# EAGLE design VDC (EAGLE 6.0)
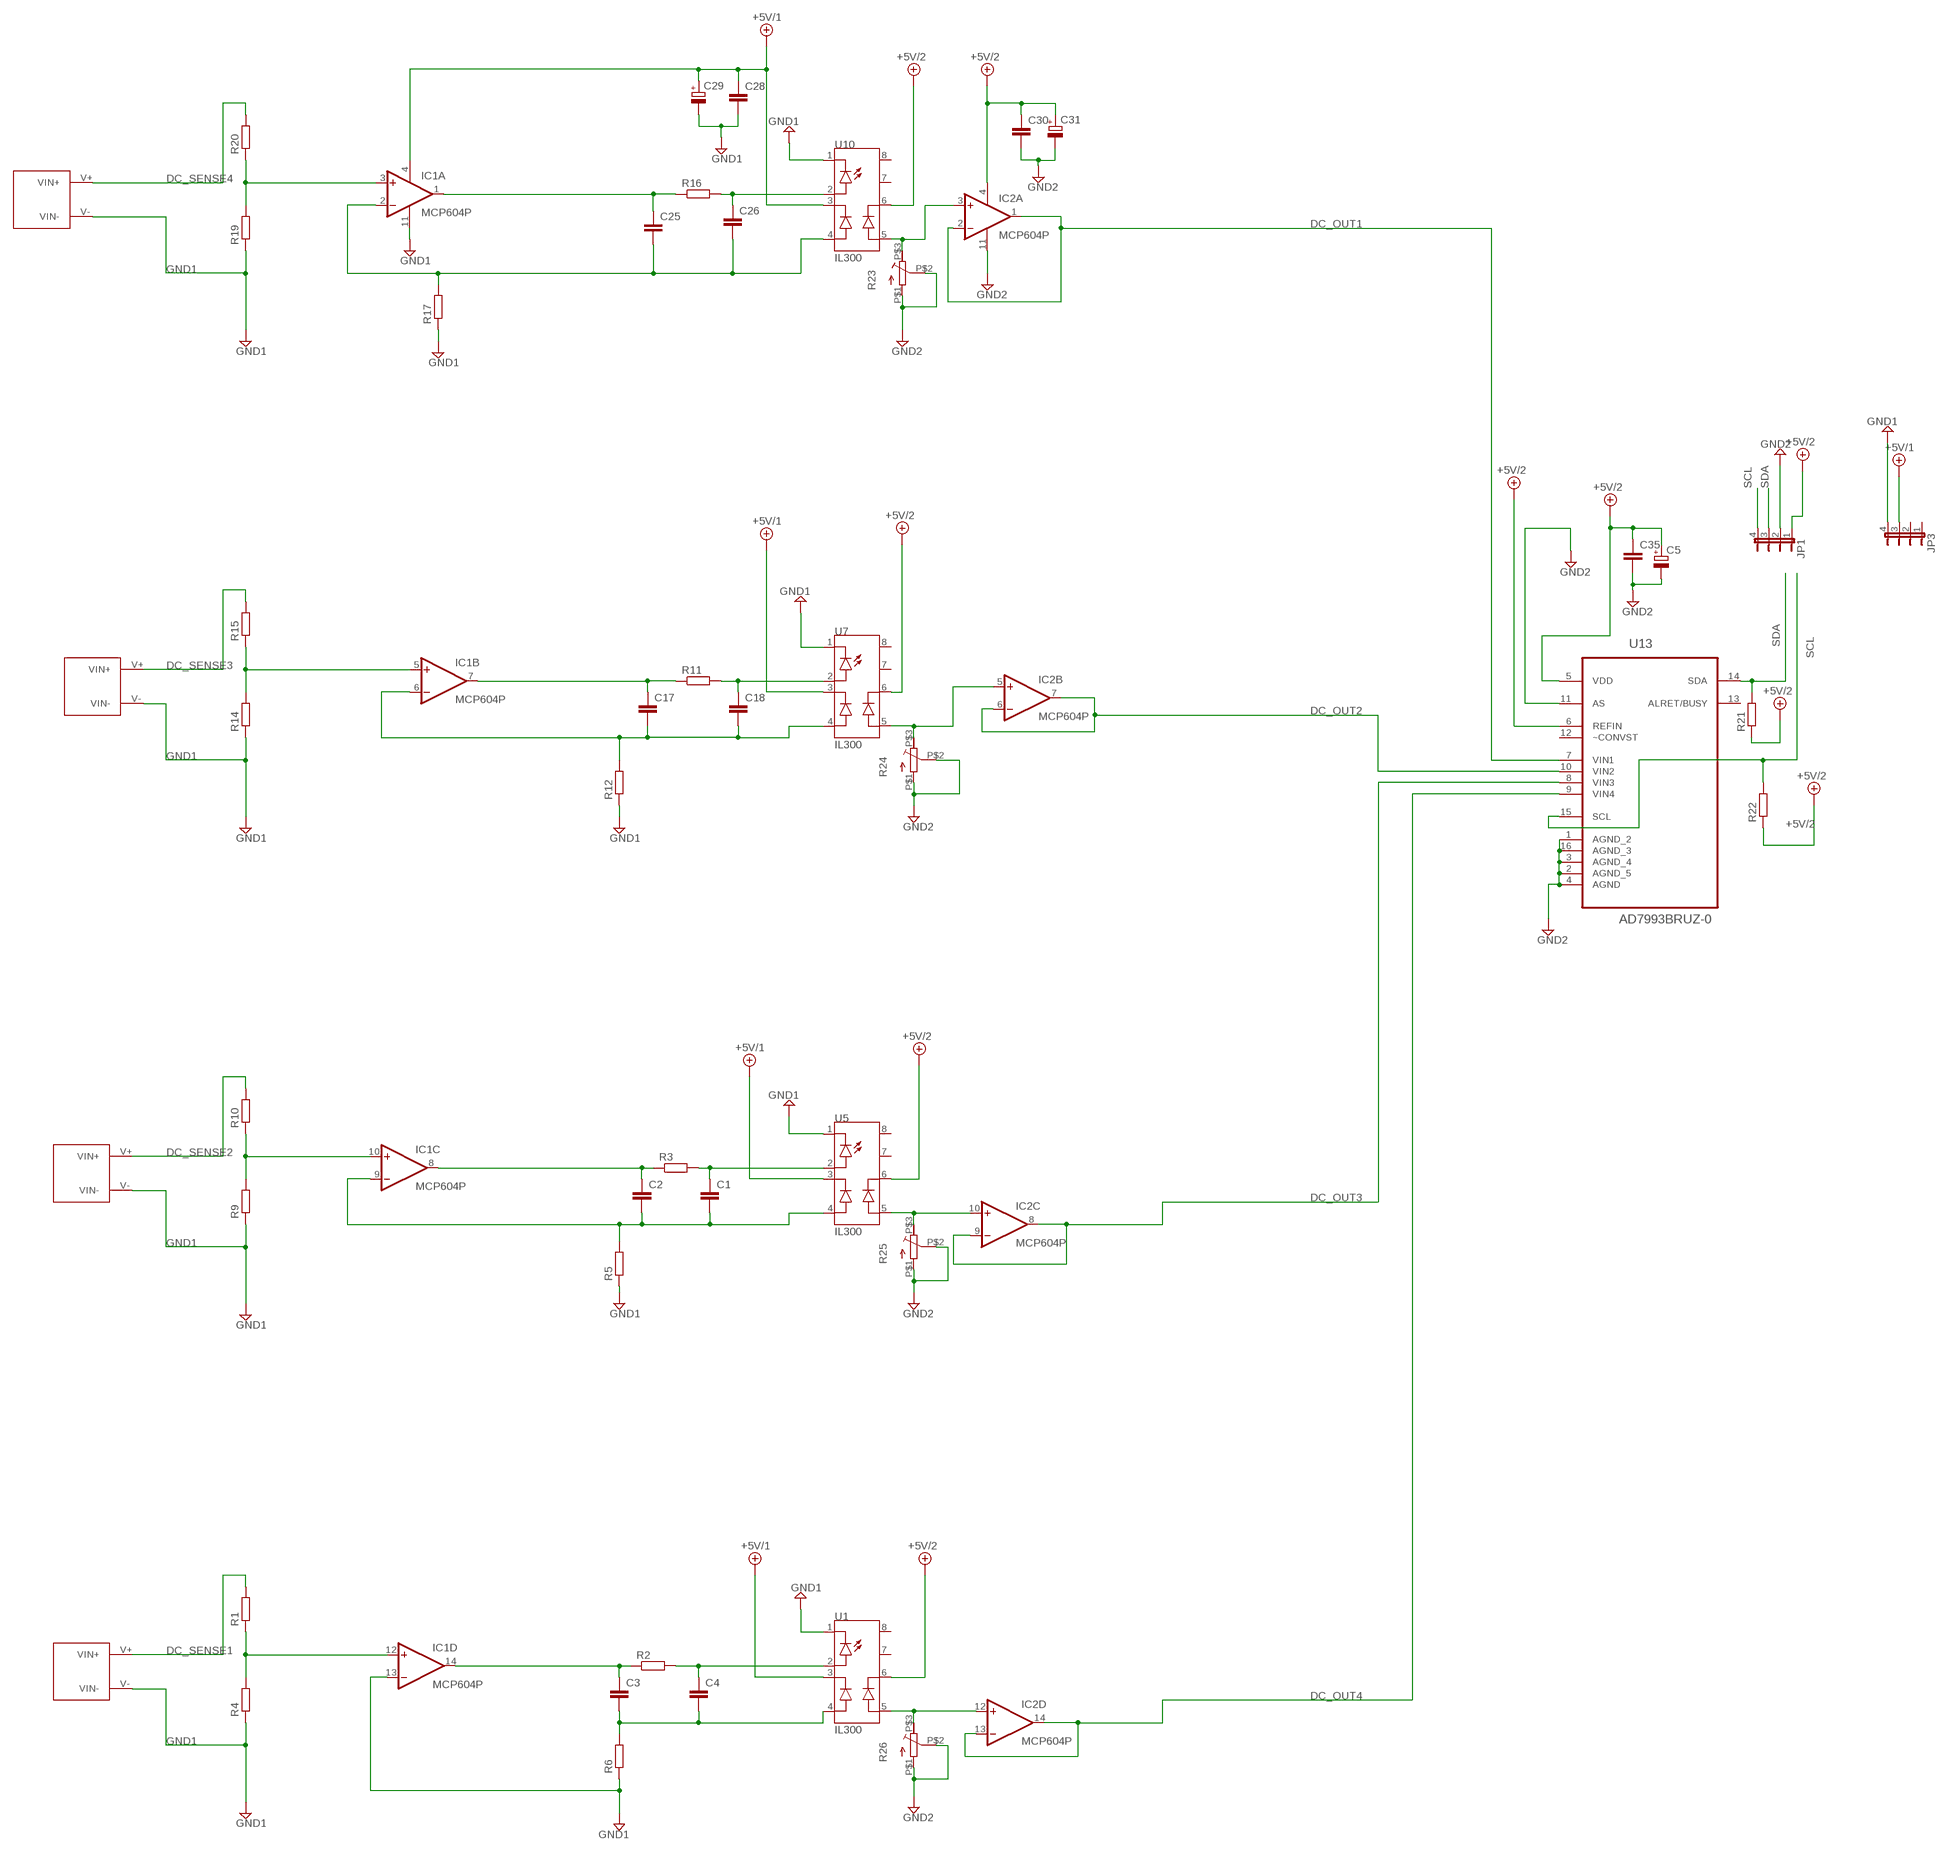
[diagram p0: schematic, sheet 1]

## Parts
C1  C-EU025-040X050  [C025-040X050]
C2  C-EU025-040X050  [C025-040X050]
C3  C-EU025-040X050  [C025-040X050]
C4  C-EU025-040X050  [C025-040X050]
C5  CPOL-EUE2-4  [E2-4]
C17  C-EU025-040X050  [C025-040X050]
C18  C-EU025-040X050  [C025-040X050]
C25  C-EU025-040X050  [C025-040X050]
C26  C-EU025-040X050  [C025-040X050]
C28  C-EU025-040X050  [C025-040X050]
C29  CPOL-EUE2-5  [E2-5]
C30  C-EU025-040X050  [C025-040X050]
C31  CPOL-EUE2-5  [E2-5]
C35  C-EU025-025X050  [C025-025X050]
IC1  MCP604P  [DIL14]
IC2  MCP604P  [DIL14]
JP1  JP4E  [JP4]
JP3  JP4E  [JP4]
R1  R-EU_0207/10  [0207/10]
R2  R-EU_0207/10  [0207/10]
R3  R-EU_0207/10  [0207/10]
R4  R-EU_0207/10  [0207/10]
R5  R-EU_0207/10  [0207/10]
R6  R-EU_0207/10  [0207/10]
R9  R-EU_0207/10  [0207/10]
R10  R-EU_0207/10  [0207/10]
R11  R-EU_0207/10  [0207/10]
R12  R-EU_0207/10  [0207/10]
R14  R-EU_0207/10  [0207/10]
R15  R-EU_0207/10  [0207/10]
R16  R-EU_0207/10  [0207/10]
R17  R-EU_0207/10  [0207/10]
R19  R-EU_0207/10  [0207/10]
R20  R-EU_0207/10  [0207/10]
R21  R-EU_0207/10  [0207/10]
R22  R-EU_0207/10  [0207/10]
R23  R-TRIMM  [IRG2014TRIM]
R24  R-TRIMM  [IRG2014TRIM]
R25  R-TRIMM  [IRG2014TRIM]
R26  R-TRIMM  [IRG2014TRIM]
U1  IL300  [DIL08]
U5  IL300  [DIL08]
U7  IL300  [DIL08]
U10  IL300  [DIL08]
U13  AD7993BRUZ-0  [SOP65P640X120-16N]
U$5  INPUT_VOLTAGE_CONNECTOR  [INPUT_VOLTAGE_CONNECTOR]
U$6  INPUT_VOLTAGE_CONNECTOR  [INPUT_VOLTAGE_CONNECTOR]
U$7  INPUT_VOLTAGE_CONNECTOR  [INPUT_VOLTAGE_CONNECTOR]
U$8  INPUT_VOLTAGE_CONNECTOR  [INPUT_VOLTAGE_CONNECTOR]

## Nets
+5V/1: C28.1 C29.+ IC1.4(P:V+) JP3.3 U1.3(C_FB) U5.3(C_FB) U7.3(C_FB) U10.3(C_FB)
+5V/2: C5.+ C30.1 C31.+ C35.1 IC2.4(P:V+) JP1.1 R21.1 R22.1 U1.6(C_OUT) U5.6(C_OUT) U7.6(C_OUT) U10.6(C_OUT) U13.5(VDD) U13.6(REFIN)
DC_OUT1: IC2.1(A:OUT) IC2.2(A:-IN) U13.7(VIN1)
DC_OUT2: IC2.6(B:-IN) IC2.7(B:OUT) U13.10(VIN2)
DC_OUT3: IC2.8(C:OUT) IC2.9(C:-IN) U13.8(VIN3)
DC_OUT4: IC2.13(D:-IN) IC2.14(D:OUT) U13.9(VIN4)
DC_SENSE1: R1.2 U$8.V+(VIN+)
DC_SENSE2: R10.2 U$7.V+(VIN+)
DC_SENSE3: R15.2 U$6.V+(VIN+)
DC_SENSE4: R20.2 U$5.V+(VIN+)
GND1: C28.2 C29.- IC1.11(P:V-) IC1.13(D:-IN) JP3.4 R4.1 R5.1 R6.1 R9.1 R12.1 R14.1 R17.1 R19.1 U1.1(C_LED) U5.1(C_LED) U7.1(C_LED) U10.1(C_LED) U$5.V-(VIN-) U$6.V-(VIN-) U$7.V-(VIN-) U$8.V-(VIN-)
GND2: C5.- C30.2 C31.- C35.2 IC2.11(P:V-) JP1.2 R23.P$1(A) R23.P$2(S) R24.P$1(A) R24.P$2(S) R25.P$1(A) R25.P$2(S) R26.P$1(A) R26.P$2(S) U13.1(AGND_2) U13.2(AGND_5) U13.3(AGND_4) U13.4(AGND) U13.11(AS) U13.16(AGND_3)
N$1: C3.2 C4.2 R6.2 U1.4(A_FB)
N$2: C1.2 C2.2 IC1.9(C:-IN) R5.2 U5.4(A_FB)
N$3: IC2.12(D:+IN) R26.P$3(E) U1.5(A_OUT)
N$4: C4.1 R2.2 U1.2(A_LED)
N$5: C3.1 IC1.14(D:OUT) R2.1
N$6: C1.1 R3.2 U5.2(A_LED)
N$7: C2.1 IC1.8(C:OUT) R3.1
N$8: IC1.12(D:+IN) R1.1 R4.2
N$9: IC2.10(C:+IN) R25.P$3(E) U5.5(A_OUT)
N$10: IC1.10(C:+IN) R9.2 R10.1
N$12: C18.1 R11.2 U7.2(A_LED)
N$13: C17.1 IC1.7(B:OUT) R11.1
N$14: IC2.5(B:+IN) R24.P$3(E) U7.5(A_OUT)
N$15: IC1.5(B:+IN) R14.2 R15.1
N$16: C25.2 C26.2 IC1.2(A:-IN) R17.2 U10.4(A_FB)
N$17: C26.1 R16.2 U10.2(A_LED)
N$18: C25.1 IC1.1(A:OUT) R16.1
N$19: IC2.3(A:+IN) R23.P$3(E) U10.5(A_OUT)
N$20: IC1.3(A:+IN) R19.2 R20.1
N$23: C17.2 C18.2 IC1.6(B:-IN) R12.2 U7.4(A_FB)
SCL: JP1.4 R22.2 U13.15(SCL)
SDA: JP1.3 R21.2 U13.14(SDA)
Unconnected: JP3.1 JP3.2 U1.7(PIN7) U1.8(PIN8) U5.7(PIN7) U5.8(PIN8) U7.7(PIN7) U7.8(PIN8) U10.7(PIN7) U10.8(PIN8) U13.12(~CONVST) U13.13(ALRET/BUSY)

## Library data of the parts
C1-C4 C17 C18 C25 C26 C28 C30 C35 = resistor:C-EU: CAPACITOR, European symbol
C5 C29 C31 = resistor:CPOL-EU: POLARIZED CAPACITOR, European symbol
IC1 IC2 = linear - Power:MCP604: Quad Op Amp 2.7V to 6.0V Single Supply CMOS Source: http://ww1.microchip.com/downloads/en/DeviceDoc/21314g.pdf
JP1 JP3 = jumper:JP4E: JUMPER
R1-R6 R9-R12 R14-R17 R19-R22 = resistor:R-EU_: RESISTOR, European symbol
R23-R26 = rcl:R-TRIMM: Trimm resistor
U1 U5 U7 U10 = ic-optoisolator:IL300
U13 = ADC:AD7993BRUZ-0: ADC; MPN: AD7993BRUZ-0; OC_FARNELL: 1078309; OC_NEWARK: 59K6101; PACKAGE: TSSOP-16; SUPPLIER: Analog Devices
U$5-U$8 = ekohub2013:INPUT_VOLTAGE_CONNECTOR

## Board
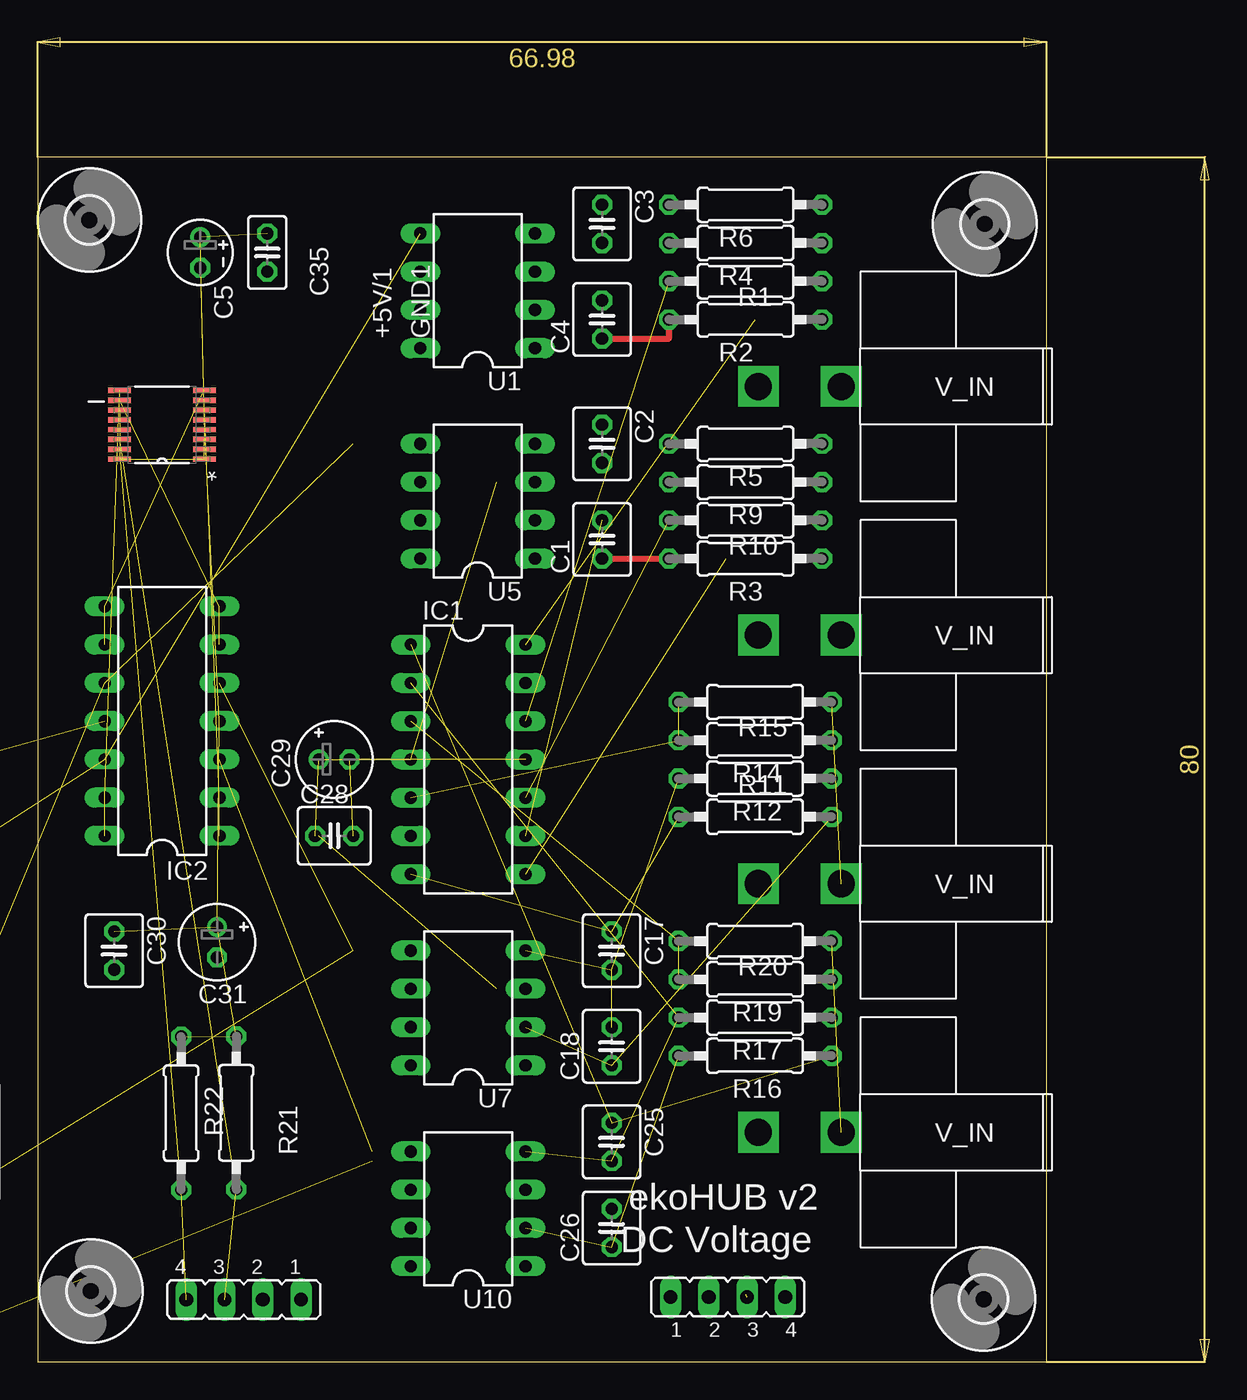
[diagram p1: board, top side]
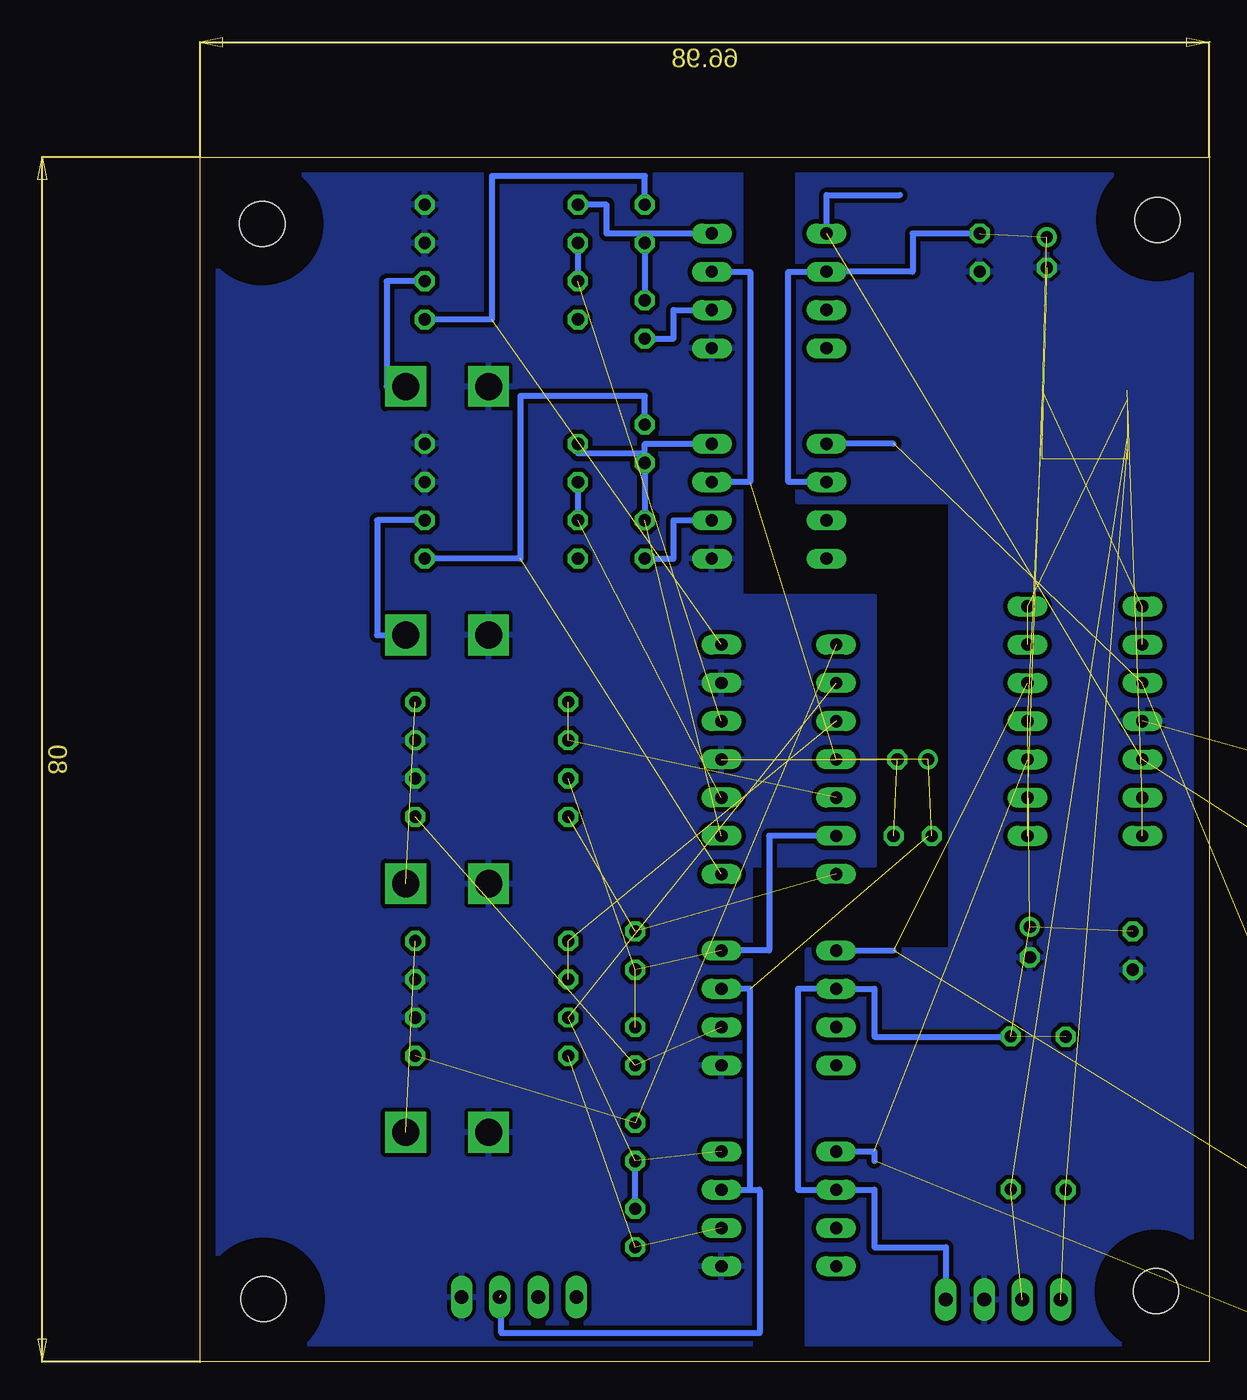
[diagram p2: board, bottom side, seen from below]

Size 66.98 x 80 mm. Coordinates in mm from the lower left corner, seen from the top.
Outline: 0,0 66.98,0 66.98,80 0,80 0,0
Copper layers (1*16): Top 0.035mm / dielectric 1.5mm / Bottom 0.035mm
Design rules: minimum track width 10mil, minimum drill 24mil, track to track 12mil, track to pad 12mil, pad to pad 12mil, via to via 12mil, smd to smd 12mil, copper to edge 40mil, drill to drill 8mil, minimum pad ring 10mil, minimum via ring 8mil, stop-mask expansion 4mil, vias tented up to drill 0mil, thermal gap 10mil

### Footprints (pad centres in the part's own frame; a part is rotated, then mirrored left to right if it is on the bottom)
C025-040X050 = drill 0.813 octagon: 1 -1.27,0; 2 1.27,0
E2-4 = drill 0.813 pad 1.27: + -1.016,0 | drill 0.813 pad 1.27 octagon: - 1.016,0
E2-5 = drill 0.813 pad 1.27: + -1.016,0 | drill 0.813 pad 1.27 octagon: - 1.016,0
C025-025X050 = drill 0.813 octagon: 1 -1.27,0; 2 1.27,0
DIL14 = drill 0.813 long: 1 -7.62,-3.81; 2 -5.08,-3.81; 3 -2.54,-3.81; 4 0,-3.81; 5 2.54,-3.81; 6 5.08,-3.81; 7 7.62,-3.81; 8 7.62,3.81; 9 5.08,3.81; 10 2.54,3.81; 11 0,3.81; 12 -2.54,3.81; 13 -5.08,3.81; 14 -7.62,3.81
JP4 = drill 0.914 long: 1 -3.81,0; 2 -1.27,0; 3 1.27,0; 4 3.81,0
0207/10 = drill 0.813 octagon: 1 -5.08,0; 2 5.08,0
IRG2014TRIM = drill 0.8 square: P$1 0,0; P$2 2.54,5.08; P$3 5.08,0
DIL08 = drill 0.813 long: 1 -3.81,-3.81; 2 -1.27,-3.81; 3 1.27,-3.81; 4 3.81,-3.81; 5 3.81,3.81; 6 1.27,3.81; 7 -1.27,3.81; 8 -3.81,3.81
SOP65P640X120-16N = smd 1.473 x 0.356: 1 -2.819,2.286; 2 -2.819,1.626; 3 -2.819,0.965; 4 -2.819,0.33; 5 -2.819,-0.33; 6 -2.819,-0.965; 7 -2.819,-1.626; 8 -2.819,-2.286; 9 2.819,-2.286; 10 2.819,-1.626; 11 2.819,-0.965; 12 2.819,-0.33; 13 2.819,0.33; 14 2.819,0.965; 15 2.819,1.626; 16 2.819,2.286
3,0 = hole 3: 0,0
INPUT_VOLTAGE_CONNECTOR = drill 1.8 square: V+ 0,0; V- 5.5,0

### Placement (x,y rotation side)
C1  37.47,54.61 90 top
C2  37.47,60.96 270 top
C3  37.47,75.56 270 top
C4  37.47,69.22 90 top
C5  10.79,73.66 270 top
C17  38.1,27.3 270 top
C18  38.1,20.95 90 top
C25  38.1,14.61 270 top
C26  38.1,8.89 90 top
C28  19.68,34.92 0 top
C29  19.68,40.01 0 top
C30  5.08,27.3 270 top
C31  11.91,27.87 270 top
C35  15.24,73.66 270 top
IC1  28.57,40.01 270 top
IC2  8.26,42.55 90 top
JP1  13.68,4.14 180 top
JP3  45.82,4.3 0 top
R1  46.99,71.75 0 top
R2  46.99,69.22 180 top
R3  46.99,53.34 180 top
R4  46.99,74.3 180 top
R5  46.99,60.96 180 top
R6  46.99,76.83 180 top
R9  46.99,58.42 180 top
R10  46.99,55.88 0 top
R11  47.62,36.2 0 top
R12  47.62,38.73 180 top
R14  47.62,41.27 180 top
R15  47.62,43.81 0 top
R16  47.62,20.32 180 top
R17  47.62,22.86 180 top
R19  47.62,25.4 180 top
R20  47.62,27.94 0 top
R21  13.18,16.54 270 top
R22  9.53,16.51 270 top
R23  -9.53,2.54 0 top  (outside the outline)
R24  -8.89,12.06 0 top  (outside the outline)
R25  -10.16,22.23 0 top  (outside the outline)
R26  -9.53,34.29 0 top  (outside the outline)
U1  29.21,71.12 90 top
U5  29.21,57.15 90 top
U7  28.57,23.5 90 top
U10  28.57,10.16 90 top
U13  8.26,62.23 180 top
U$1  [3,0]  3.53,4.7 0 top
U$2  [3,0]  62.87,75.56 0 top
U$3  [3,0]  62.79,4.17 0 top
U$4  [3,0]  3.43,75.82 0 top
U$5  53.34,15.24 180 top
U$6  53.34,31.75 180 top
U$7  53.34,48.26 180 top
U$8  53.34,64.77 180 top

### Tracks (layer width: path | path; a pad name or v marks a point on that pad's centre or on a via)
+5V/1  (5 unrouted)
  Bottom 0.406: U1.3 30.48,72.39 30.48,58.42 U5.3 | 30.48,11.43 30.48,24.77 U7.3 | U10.3 30.48,11.43 | 30.48,11.43 29.84,11.43 29.84,1.91 46.99,1.91 46.99,4.45 | C28.1 18.67,34.92
+5V/2  (8 unrouted)
  Bottom 0.406: C35.1 19.68,74.93 19.68,72.39 U1.6 27.94,72.39 27.94,58.42 U5.6 | JP1.1 17.48,7.62 22.23,7.62 22.23,11.43 U10.6 27.3,11.43 27.3,24.77 U7.6 22.23,24.77 22.23,21.59 13.18,21.59 R21.1
DC_OUT1  (2 unrouted)
DC_OUT2  (2 unrouted)
DC_OUT3  (2 unrouted)
DC_OUT4  (2 unrouted)
DC_SENSE1
  Bottom 0.406: R1.2 54.61,71.75 54.61,64.77 U$8.V+
DC_SENSE2
  Bottom 0.406: R10.2 55.24,55.88 55.24,48.26 U$7.V+
DC_SENSE3  (1 unrouted)
DC_SENSE4  (1 unrouted)
GND1  (2 unrouted)
  pour Bottom: 66.67,0 30.48,0 30.48,33.02 22.23,33.02 22.23,50.8 31.11,50.8 31.11,80.01 66.67,80.01
GND2  (14 unrouted)
  pour Bottom: 0,80.01 27.3,80.01 27.3,57.15 17.14,57.15 17.14,27.3 26.67,27.3 26.67,0 0,0
N$1
  Bottom 0.406: U1.4 37.47,74.93 | 37.47,74.93 C3.2 C4.2 | 37.47,74.93 40.01,74.93 40.01,76.83 R6.2
N$2  (1 unrouted)
  Bottom 0.406: 37.47,60.33 37.47,60.96 U5.4 | 37.47,60.33 C2.2 C1.2 | 37.47,60.33 41.91,60.33 R5.2
N$3  (2 unrouted)
  Bottom 0.406: U1.5 25.4,77.47 20.54,77.47
N$4
  Top 0.406: C4.1 41.91,67.94 R2.2
  Bottom 0.406: C4.1 35.56,67.94 35.56,69.85 U1.2
N$5  (1 unrouted)
  Bottom 0.406: C3.1 37.47,78.74 47.62,78.74 47.62,69.22 R2.1
N$6
  Top 0.406: C1.1 R3.2
  Bottom 0.406: C1.1 35.56,53.34 35.56,55.88 U5.2
N$7  (1 unrouted)
  Bottom 0.406: C2.1 37.47,64.14 45.72,64.14 45.72,53.34 R3.1
N$8  (1 unrouted)
  Bottom 0.406: R4.2 R1.1
N$9  (2 unrouted)
  Bottom 0.406: 20.95,60.96 U5.5
N$10  (1 unrouted)
  Bottom 0.406: R9.2 R10.1
N$12  (2 unrouted)
N$13  (2 unrouted)
N$14  (2 unrouted)
  Bottom 0.406: U7.5 20.95,27.3
N$15  (2 unrouted)
N$16  (3 unrouted)
  Bottom 0.406: C26.2 C25.2
N$17  (2 unrouted)
N$18  (2 unrouted)
N$19  (2 unrouted)
  Bottom 0.406: U10.5 22.23,13.97 22.23,13.34
N$20  (2 unrouted)
N$23  (3 unrouted)
  Bottom 0.406: IC1.6 29.21,34.92 29.21,27.3 U7.4
SCL  (2 unrouted)
SDA  (2 unrouted)

### Text on the board
tPlace: +5V/1 | GND1 | ekoHUB v2 | DC Voltage